# EAGLE schematic SPEKTRUM_Current_Usage_Sense REV_A (EAGLE 7.1.0)
Spektrum Telemetry eFuel Gauge Rev A
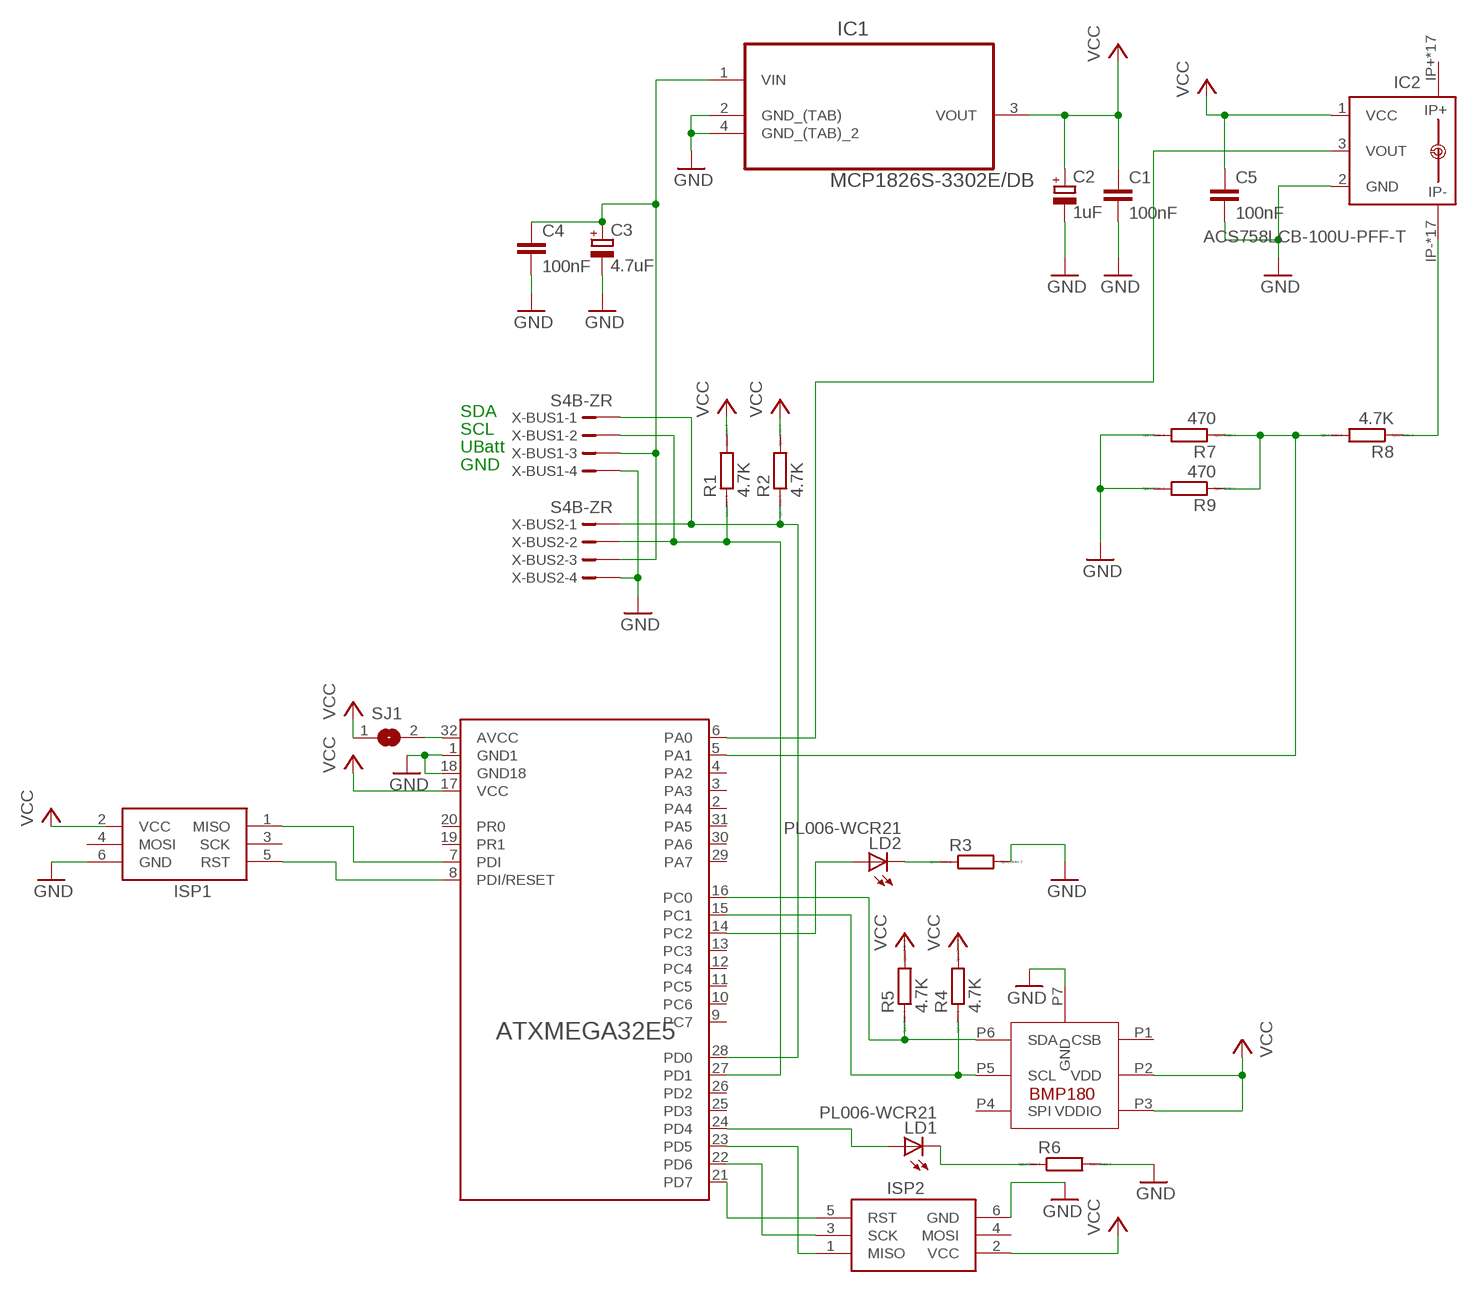
[diagram p0: schematic, sheet 1]

## Parts
ATXMEGA32E5  ATXMEGA32E5/16E5/8E5ATXMEGA32E5-AU  [TQFP32-08]
C1  100nF  C-EUC0603  [C0603]
C2  1uF  CPOL-EUA/3216-18W  [A/3216-18W]
C3  4.7uF  CPOL-EUA/3216-18W  [A/3216-18W]
C4  100nF  C-EUC0603  [C0603]
C5  100nF  C-EUC0603  [C0603]
IC1  MCP1826S-3302E/DB  [SOT230P700X180-4N]
IC2  ACS758LCB-100U-PFF-T  ACS758LCB-100B-PFF-T  [CB-PFF]
ISP1  AVRISP-6  [AVRISP]
ISP2  AVRISP-6  [AVRISP]
LD1  PL006-WCR21  [SOT23]
LD2  PL006-WCR21  [SOT23]
R1  4.7K  R-EU_M1206  [M1206]
R2  4.7K  R-EU_M1206  [M1206]
R3  R-EU_M1206  [M1206]
R4  4.7K  R-EU_M1206  [M1206]
R5  4.7K  R-EU_M1206  [M1206]
R6  R-EU_M1206  [M1206]
R7  470  R-EU_M1206  [M1206]
R8  4.7K  R-EU_M1206  [M1206]
R9  470  R-EU_M1206  [M1206]
SJ1  SJ  [SJ]
U$1  BMP180  [BMP180_LGA7]
X-BUS1  S4B-ZR  [S4B-ZR]
X-BUS2  S4B-ZR  [S4B-ZR]

## Nets
GND: ATXMEGA32E5.1(GND1) ATXMEGA32E5.18(GND18) C1.2 C2.- C3.- C4.2 C5.2 IC1.2(GND_(TAB)) IC1.4(GND_(TAB)_2) IC2.2(GND) ISP1.6(GND) ISP2.6(GND) R3.2 R6.2 R7.2 R9.2 U$1.P7(GND) X-BUS1.4 X-BUS2.4
N$1: ATXMEGA32E5.6(PA0) IC2.3(VOUT)
N$2: C3.+ C4.1 IC1.1(VIN) X-BUS1.3 X-BUS2.3
N$3: LD2.1(C) R3.1
N$4: ATXMEGA32E5.27(PD1) R1.1 X-BUS1.2 X-BUS2.2
N$5: ATXMEGA32E5.28(PD0) R2.1 X-BUS1.1 X-BUS2.1
N$6: LD1.1(C) R6.1
N$7: ATXMEGA32E5.14(PC2) LD2.3(A)
N$10: ATXMEGA32E5.16(PC0) R5.1 U$1.P6(SDA)
N$11: ATXMEGA32E5.15(PC1) R4.1 U$1.P5(SCL)
N$12: ATXMEGA32E5.7(PDI) ISP1.1(MISO)
N$13: ATXMEGA32E5.8(PDI/RESET) ISP1.5(RST)
N$14: ATXMEGA32E5.24(PD4) LD1.3(A)
N$15: ATXMEGA32E5.32(AVCC) SJ1.2
N$16: IC2.IP- IC2.IP-@2(IP-) IC2.IP-@3(IP-) IC2.IP-@4(IP-) IC2.IP-@5(IP-) IC2.IP-@6(IP-) IC2.IP-@7(IP-) IC2.IP-@8(IP-) IC2.IP-@9(IP-) IC2.IP-@10(IP-) IC2.IP-@11(IP-) IC2.IP-@12(IP-) IC2.IP-@13(IP-) IC2.IP-@14(IP-) IC2.IP-@15(IP-) IC2.IP-@16(IP-) IC2.IP-@17(IP-) R8.1
N$17: ATXMEGA32E5.5(PA1) R7.1 R8.2 R9.1
N$22: ATXMEGA32E5.21(PD7) ISP2.5(RST)
N$23: ATXMEGA32E5.22(PD6) ISP2.3(SCK)
N$24: ATXMEGA32E5.23(PD5) ISP2.1(MISO)
VCC: ATXMEGA32E5.17(VCC) C1.1 C2.+ C5.1 IC1.3(VOUT) IC2.1(VCC) ISP2.2(VCC) R1.2 R2.2 R4.2 R5.2 SJ1.1 U$1.P2(VDD) U$1.P3(VDDIO)
Unconnected: ATXMEGA32E5.2(PA4) ATXMEGA32E5.3(PA3) ATXMEGA32E5.4(PA2) ATXMEGA32E5.9(PC7) ATXMEGA32E5.10(PC6) ATXMEGA32E5.11(PC5) ATXMEGA32E5.12(PC4) ATXMEGA32E5.13(PC3) ATXMEGA32E5.19(PR1) ATXMEGA32E5.20(PR0) ATXMEGA32E5.25(PD3) ATXMEGA32E5.26(PD2) ATXMEGA32E5.29(PA7) ATXMEGA32E5.30(PA6) ATXMEGA32E5.31(PA5) IC2.IP+ IC2.IP+@2(IP+) IC2.IP+@3(IP+) IC2.IP+@4(IP+) IC2.IP+@5(IP+) IC2.IP+@6(IP+) IC2.IP+@7(IP+) IC2.IP+@8(IP+) IC2.IP+@9(IP+) IC2.IP+@10(IP+) IC2.IP+@11(IP+) IC2.IP+@12(IP+) IC2.IP+@13(IP+) IC2.IP+@14(IP+) IC2.IP+@15(IP+) IC2.IP+@16(IP+) IC2.IP+@17(IP+) ISP1.3(SCK) ISP1.4(MOSI) ISP2.4(MOSI) U$1.P1(CSB) U$1.P4(SPI)

## Notes on the sheet
- SDA
- SCL
- UBatt
- GND

## Power pins joined to a net without a drawn wire
VCC: ISP1.2(VCC)

## Library data of the parts
ATXMEGA32E5 = atmega-atxmega:ATXMEGA32E5/16E5/8E5: 8/16-bit Atmel AVR XMEGA Microcontrollers
C1 C4 C5 = rcl:C-EU: CAPACITOR, European symbol
C2 C3 = rcl:CPOL-EU: POLARIZED CAPACITOR, European symbol
IC1 = microchip_ldo:MCP1826S-3302E/DB: IC, LDO, 3.3V, 1A; MPN: MCP1826S-3302E/DB; OC_FARNELL: 1578424; OC_NEWARK: 27M0037; PACKAGE: SOT-223-3; SUPPLIER: Microchip
IC2 = allegro:ACS758*: Thermally Enhanced, Fully Integrated, Hall Effect-Based Linear Current Sensor with 100 micro Ohm Current Conductor display layer 49 Reference in BRD and place VIAs on circles Source: http://www.allegromicro.com/en/Products/Part_Numbers/0758/0758.pdf; MPN: ACS758LCB-100U-PFF-T; OC_FARNELL: 1718998; OC_NEWARK: 04R7132
ISP1 ISP2 = adafruit:AVRISP: AVR ISP HEADER Standard 6 pin header for AVR programming
LD1 LD2 = led:PL006*: PLH006 Series SMD LED SOT23 PLH006-WCR21 Super Red PLH006-WCR12 High Eff Red PLH006-WCG13 Green PLH006-WCY01 Yellow www.p-tec.net Source: http://www.wittig-electronic.de/PTEC/PL006Series.pdf
R1-R9 = resistor:R-EU_: RESISTOR, European symbol; SPICEPREFIX: R
SJ1 = jumper:SJ: SMD solder JUMPER
U$1 = bosch_sensors:BMP180: BMP 180 Digital Pressure Sensor with I2C Interface
X-BUS1 X-BUS2 = con-jst:?4B-ZR: ZH CONNECTOR 1.5 mm, 4 pin 1 row Source: http://www.jst.com .. eZH.pdf; MF: FARNELL; MPN: S4B-ZR(LF)(SN); OC_FARNELL: 9491830; OC_NEWARK: 38K8076